# Altium schematic sheet Main.SchDoc
size A4; SheetNumber: 1; SheetTotal: 5
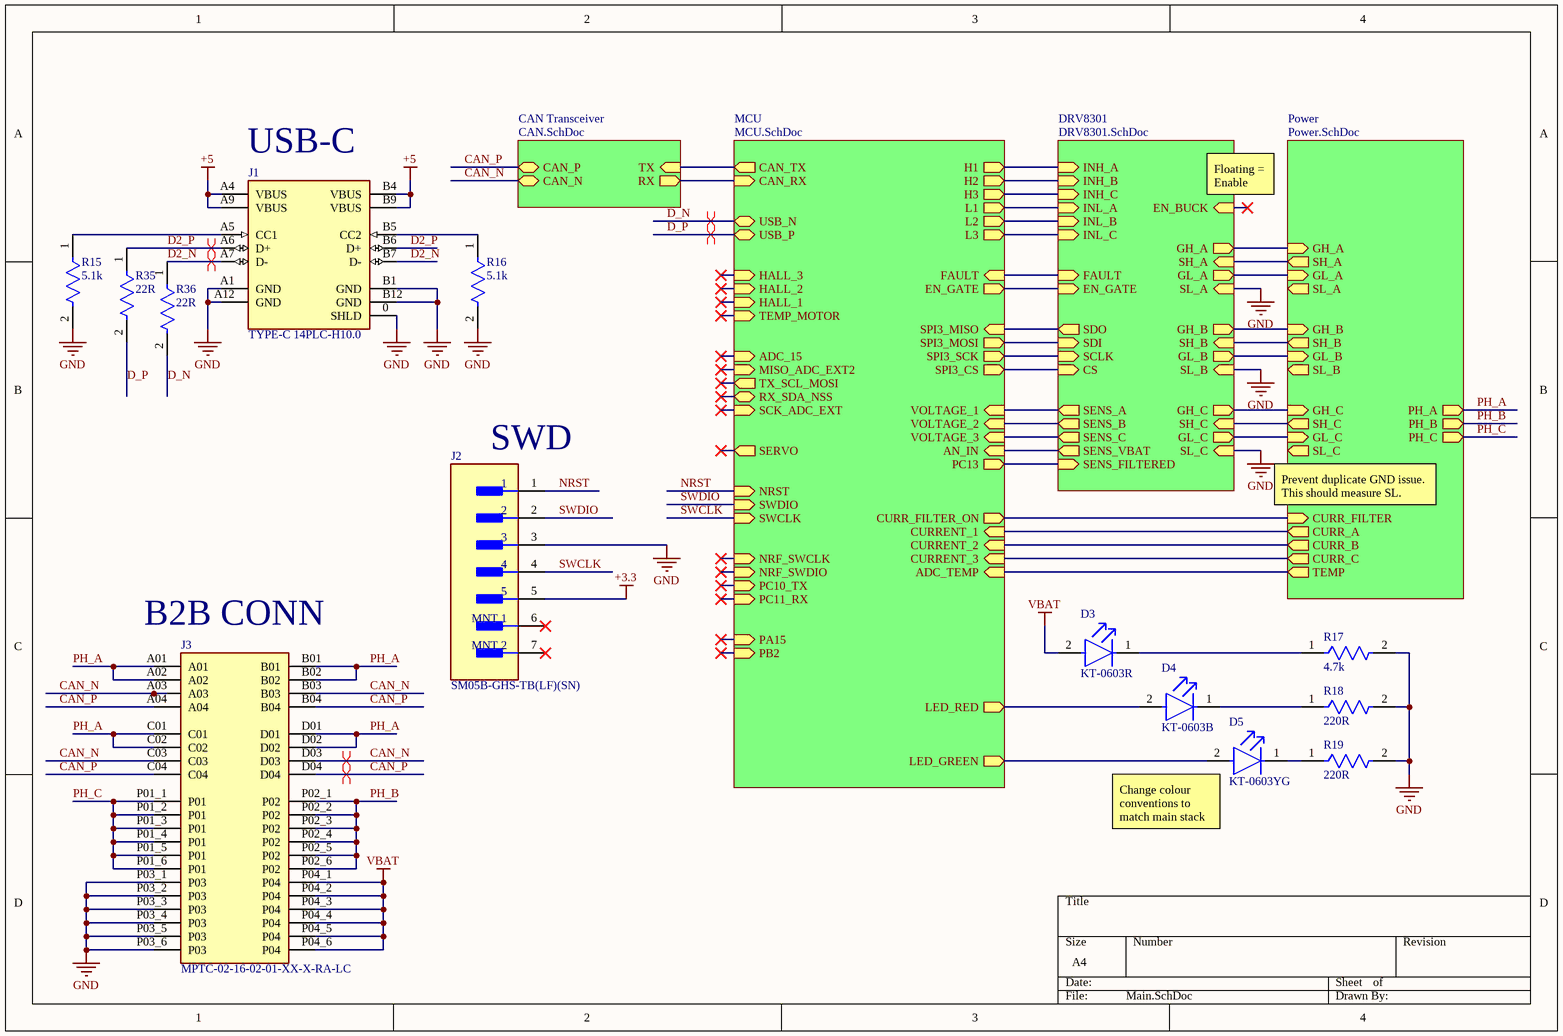
[diagram p0: Main.SchDoc]

## Parts
D3  KT-0603R  [KT-0603R]
D4  KT-0603B  [KT-0603B]
D5  KT-0603YG  [KT-0603YG]
J1  TYPE-C 14PLC-H10.0  [TYPE-C 14PLC-H10.0]
J2  SM05B-GHS-TB(LF)(SN)  [SM05B-GHS-TB(LF)(SN)]
J3  MPTC-02-16-02-01-XX-X-RA-LC  [SAMTEC_MPTC-02-16-02-01-XX-X-RA-LC]
R15  5.1k  [FP-AC0402-MFG]
R16  5.1k  [FP-AC0402-MFG]
R17  4.7k  [FP-AC0402-MFG]
R18  220R  [FP-AC0402-MFG]
R19  220R  [FP-AC0402-MFG]
R35  22R  [FP-AC0402-MFG]
R36  22R  [FP-AC0402-MFG]

## Sub-sheets
CAN Transceiver = CAN.SchDoc: TX (in), RX (out), CAN_P (bidir), CAN_N (bidir)
DRV8301 = DRV8301.SchDoc: INH_A (in), INH_B (in), INH_C (in), INL_A (in), INL_B (in), INL_C (in), FAULT (in), EN_GATE (in), SDO (out), SDI (in), SCLK (in), CS (in), SENS_A (out), SENS_B (out), SENS_C (out), SENS_VBAT (out), SENS_FILTERED (in), GH_A (out), SH_A (in), GL_A (out), SL_A (in), EN_BUCK (in), GH_B (out), SH_B (in), GL_B (out), SL_B (in), GH_C (out), SH_C (in), GL_C (out), SL_C (in)
MCU = MCU.SchDoc: USB_N (bidir), USB_P (bidir), CAN_TX (out), CAN_RX (in), HALL_3 (in), HALL_2 (in), HALL_1 (in), TEMP_MOTOR (in), ADC_15 (in), MISO_ADC_EXT2 (in), TX_SCL_MOSI (out), RX_SDA_NSS (bidir), SCK_ADC_EXT (in), SERVO (out), SWCLK (in), SWDIO (in), NRST (in), NRF_SWCLK (in), NRF_SWDIO (in), PC10_TX (in), PC11_RX (in), PA15 (in), PB2 (in), LED_RED (out), LED_GREEN (out), H1 (out), H3 (out), H2 (out), L1 (out), L3 (out), L2 (out), FAULT (in), EN_GATE (out), SPI3_CS (out), SPI3_SCK (out), SPI3_MOSI (out), SPI3_MISO (in), VOLTAGE_1 (in), VOLTAGE_2 (in), VOLTAGE_3 (in), AN_IN (in), PC13 (out), CURR_FILTER_ON (out), CURRENT_1 (in), CURRENT_2 (in), CURRENT_3 (in), ADC_TEMP (in)
Power = Power.SchDoc: GH_A (in), SH_A (out), GL_A (in), SL_A (out), GH_B (in), SH_B (out), GL_B (in), SL_B (out), GH_C (in), SH_C (out), GL_C (in), SL_C (out), PH_A (out), PH_B (out), PH_C (out), CURR_FILTER (in), CURR_A (out), CURR_B (out), CURR_C (out), TEMP (out)

## Nets
+3.3: J2.5
+5: J1.A4(VBUS) J1.A9(VBUS) J1.B4(VBUS) J1.B9(VBUS)
GND: J1.0(SHLD) J1.A1(GND) J1.A12(GND) J1.B1(GND) J1.B12(GND) J2.3 J3.P03_1(P03) J3.P03_2(P03) J3.P03_3(P03) J3.P03_4(P03) J3.P03_5(P03) J3.P03_6(P03) R15.2 R16.2 R17.2 R18.2 R19.2 ; sheet DRV8301/SL_A, sheet DRV8301/SL_B, sheet DRV8301/SL_C
VBAT: D3.2(A) J3.P04_1(P04) J3.P04_2(P04) J3.P04_3(P04) J3.P04_4(P04) J3.P04_5(P04) J3.P04_6(P04)
CAN_N: J3.A03 J3.B03 J3.C03 J3.D03 ; sheet CAN Transceiver/CAN_N
CAN_P: J3.A04 J3.B04 J3.C04 J3.D04 ; sheet CAN Transceiver/CAN_P
D2_N: J1.A7(D-) J1.B7(D-) R36.1
D2_P: J1.A6(D+) J1.B6(D+) R35.1
D_N: R36.2 ; sheet MCU/USB_N
D_P: R35.2 ; sheet MCU/USB_P
NRST: J2.1 ; sheet MCU/NRST
PH_A: J3.A01 J3.A02 J3.B01 J3.B02 J3.C01 J3.C02 J3.D01 J3.D02 ; sheet Power/PH_A
PH_B: J3.P02_1(P02) J3.P02_2(P02) J3.P02_3(P02) J3.P02_4(P02) J3.P02_5(P02) J3.P02_6(P02) ; sheet Power/PH_B
PH_C: J3.P01_1(P01) J3.P01_2(P01) J3.P01_3(P01) J3.P01_4(P01) J3.P01_5(P01) J3.P01_6(P01) ; sheet Power/PH_C
SWCLK: J2.4 ; sheet MCU/SWCLK
SWDIO: J2.2 ; sheet MCU/SWDIO
NetD3_1: D3.1(C) R17.1
NetD4_1: D4.1(C) R18.1
NetD4_2: D4.2(A) ; sheet MCU/LED_RED
NetD5_1: D5.1(C) R19.1
NetD5_2: D5.2(A) ; sheet MCU/LED_GREEN
NetJ1_A5: J1.A5(CC1) R15.1
NetJ1_B5: J1.B5(CC2) R16.1
(unnamed): sheet MCU/CAN_TX, sheet CAN Transceiver/TX
(unnamed): sheet MCU/CAN_RX, sheet CAN Transceiver/RX
(unnamed): sheet MCU/H1, sheet DRV8301/INH_A
(unnamed): sheet MCU/H3, sheet DRV8301/INH_C
(unnamed): sheet MCU/H2, sheet DRV8301/INH_B
(unnamed): sheet MCU/L1, sheet DRV8301/INL_A
(unnamed): sheet MCU/L3, sheet DRV8301/INL_C
(unnamed): sheet MCU/L2, sheet DRV8301/INL_B
(unnamed): sheet MCU/FAULT, sheet DRV8301/FAULT
(unnamed): sheet MCU/EN_GATE, sheet DRV8301/EN_GATE
(unnamed): sheet MCU/SPI3_CS, sheet DRV8301/CS
(unnamed): sheet MCU/SPI3_SCK, sheet DRV8301/SCLK
(unnamed): sheet MCU/SPI3_MOSI, sheet DRV8301/SDI
(unnamed): sheet MCU/SPI3_MISO, sheet DRV8301/SDO
(unnamed): sheet MCU/VOLTAGE_1, sheet DRV8301/SENS_A
(unnamed): sheet MCU/VOLTAGE_2, sheet DRV8301/SENS_B
(unnamed): sheet MCU/VOLTAGE_3, sheet DRV8301/SENS_C
(unnamed): sheet MCU/AN_IN, sheet DRV8301/SENS_VBAT
(unnamed): sheet MCU/PC13, sheet DRV8301/SENS_FILTERED
(unnamed): sheet MCU/CURR_FILTER_ON, sheet Power/CURR_FILTER
(unnamed): sheet MCU/CURRENT_1, sheet Power/CURR_A
(unnamed): sheet MCU/CURRENT_2, sheet Power/CURR_B
(unnamed): sheet MCU/CURRENT_3, sheet Power/CURR_C
(unnamed): sheet MCU/ADC_TEMP, sheet Power/TEMP
(unnamed): sheet DRV8301/GH_A, sheet Power/GH_A
(unnamed): sheet DRV8301/SH_A, sheet Power/SH_A
(unnamed): sheet DRV8301/GL_A, sheet Power/GL_A
(unnamed): sheet DRV8301/GH_B, sheet Power/GH_B
(unnamed): sheet DRV8301/SH_B, sheet Power/SH_B
(unnamed): sheet DRV8301/GL_B, sheet Power/GL_B
(unnamed): sheet DRV8301/GH_C, sheet Power/GH_C
(unnamed): sheet DRV8301/SH_C, sheet Power/SH_C
(unnamed): sheet DRV8301/GL_C, sheet Power/GL_C

Not connected (* = marked no-connect by the designer): J2 6(MNT_1)* 7(MNT_2)*

## Layout directives
differential pair: CAN_N, CAN_P, D2_N, D2_P, D_N, D_P

## Notes on the sheet
- (near J1) USB-C
- Floating = Enable
- (near J2) SWD
- Prevent duplicate GND issue.
  This should measure SL.
- (near J3) B2B CONN
- (near D5) Change colour conventions to match main stack

## Library data of the parts
D3 = KT-0603R: -40℃~+85℃ 120° 2.4V 20mA 300mcd 40mW 615nm~630nm 645nm Red Water Clear 0603 LED Indication - Discrete ROHS
D4 = KT-0603B: 100mW 120° 175mcd 3.1V 460nm~475nm 469nm 5mA Blue Water Clear 0603 LED Indication - Discrete ROHS
D5 = KT-0603YG: -40℃~+85℃ 120° 20mA 2V~2.2V 30mcd~42mcd 40mW 567nm~573nm Discrete Diode Top-mount Water Clear Yellow Green 0603 LED Indication - Discrete ROHS
J1 = TYPE-C 14PLC-H10.0: -40℃~+85℃ 1 10,000 Cycles 14P 20V 5A Black Female Through Hole Type-C USB 3.1 Plugin USB Connectors ROHS
J2 = SM05B-GHS-TB(LF)(SN): Connector Header, GH Series, 5 Position, 1.25mm, Surface Mount, Right Angle, Tin, Natural
J3 = CMP-414-000000-2: 5mm (.1969 Inch) / 2mm (.0787 Inch) Pitch Power / Signal, Board to Board / Wire to Board Shrouded Box Header Connectors, Vertical or Right Angle, Locking Clip Option, PowerStrip™/30 Amps; MF: Samtec; Price: None; Component Type: Standard; Pin Count: 40; MP: MPTC-02-16-02-01-XX-X-RA-LC; Design Item ID: MPTC-02-16-02-01-XX-X-RA-LC; Availability: Unavailable; Value: *; Package: None; Source: MPTC-02-16-02-01-XX-X-RA-LC.SchLib; System: Connector
R15 R16 = 0402WGF5101TCE: -55℃~+155℃ 5.1kΩ 50V 62.5mW Thick Film Resistor ±1% ±100ppm/℃ 0402 Chip Resistor - Surface Mount ROHS
R17 = 0402WGF4701TCE: -55℃~+155℃ 4.7kΩ 50V 62.5mW Thick Film Resistor ±1% ±100ppm/℃ 0402 Chip Resistor - Surface Mount ROHS
R18 R19 = 0402WGF2200TCE: -55℃~+155℃ 220Ω 50V 62.5mW Thick Film Resistor ±1% ±100ppm/℃ 0402 Chip Resistor - Surface Mount ROHS
R35 R36 = 0402WGF220JTCE: -55℃~+155℃ 22Ω 50V 62.5mW Thick Film Resistor ±1% ±100ppm/℃ 0402 Chip Resistor - Surface Mount ROHS